# EAGLE board MainBoard (EAGLE 6.4), part 1 of 2
REVISION: B; TITLE: Teton
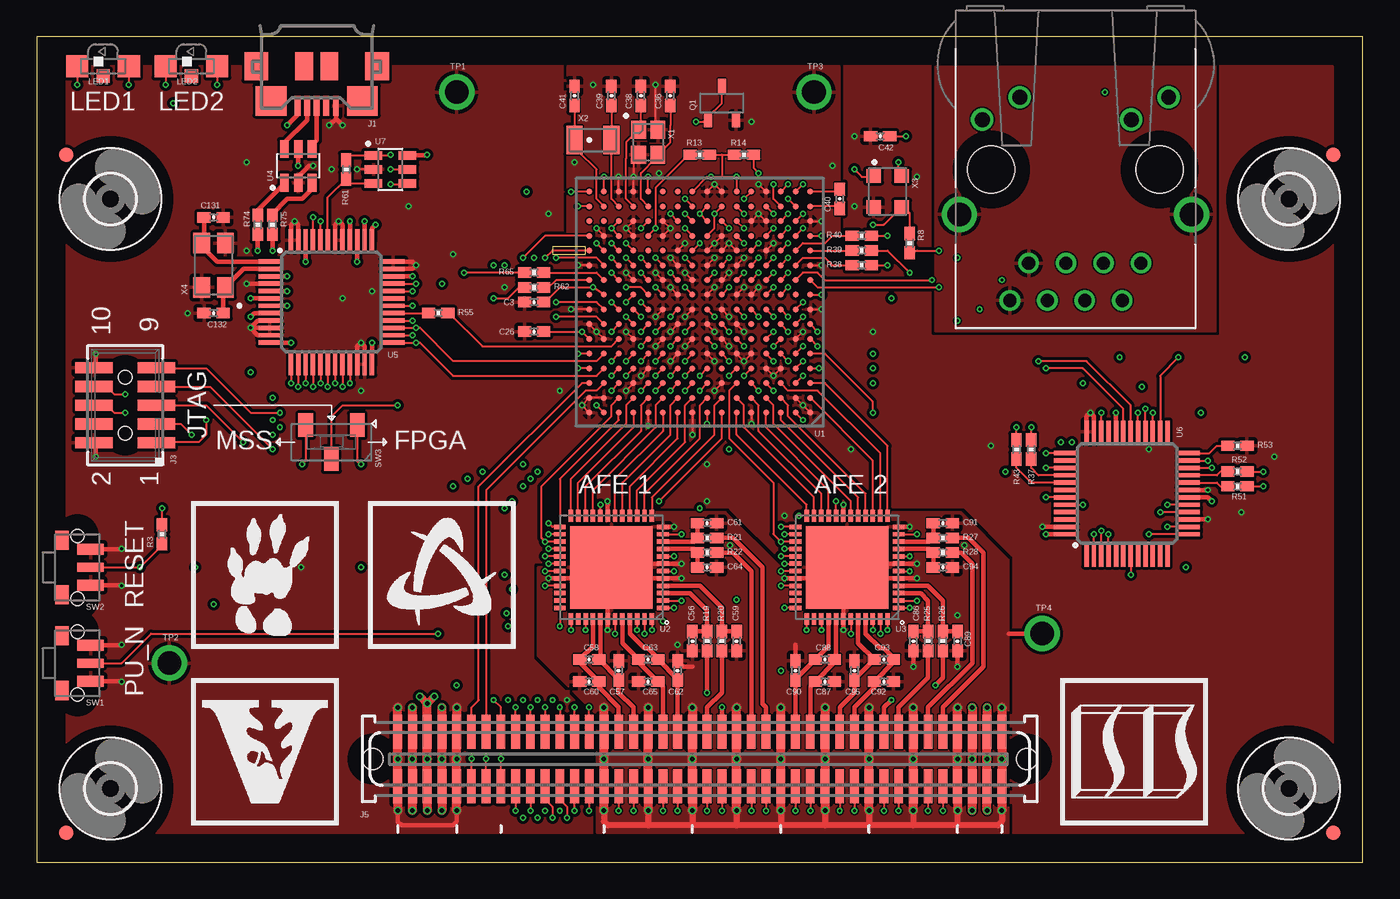
[diagram p10: board, top side]
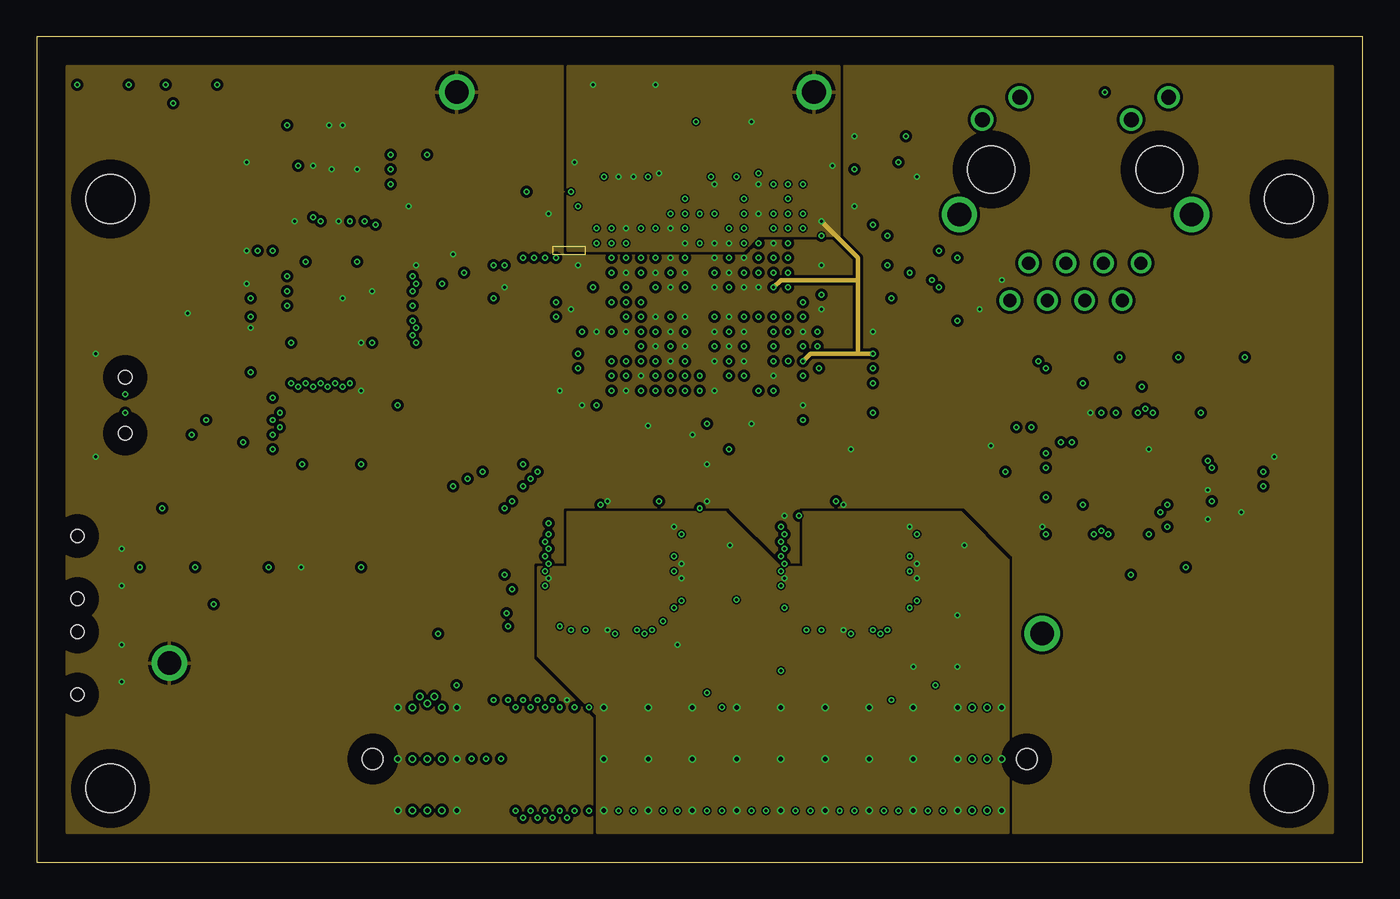
[diagram p11: board, inner layer GND]
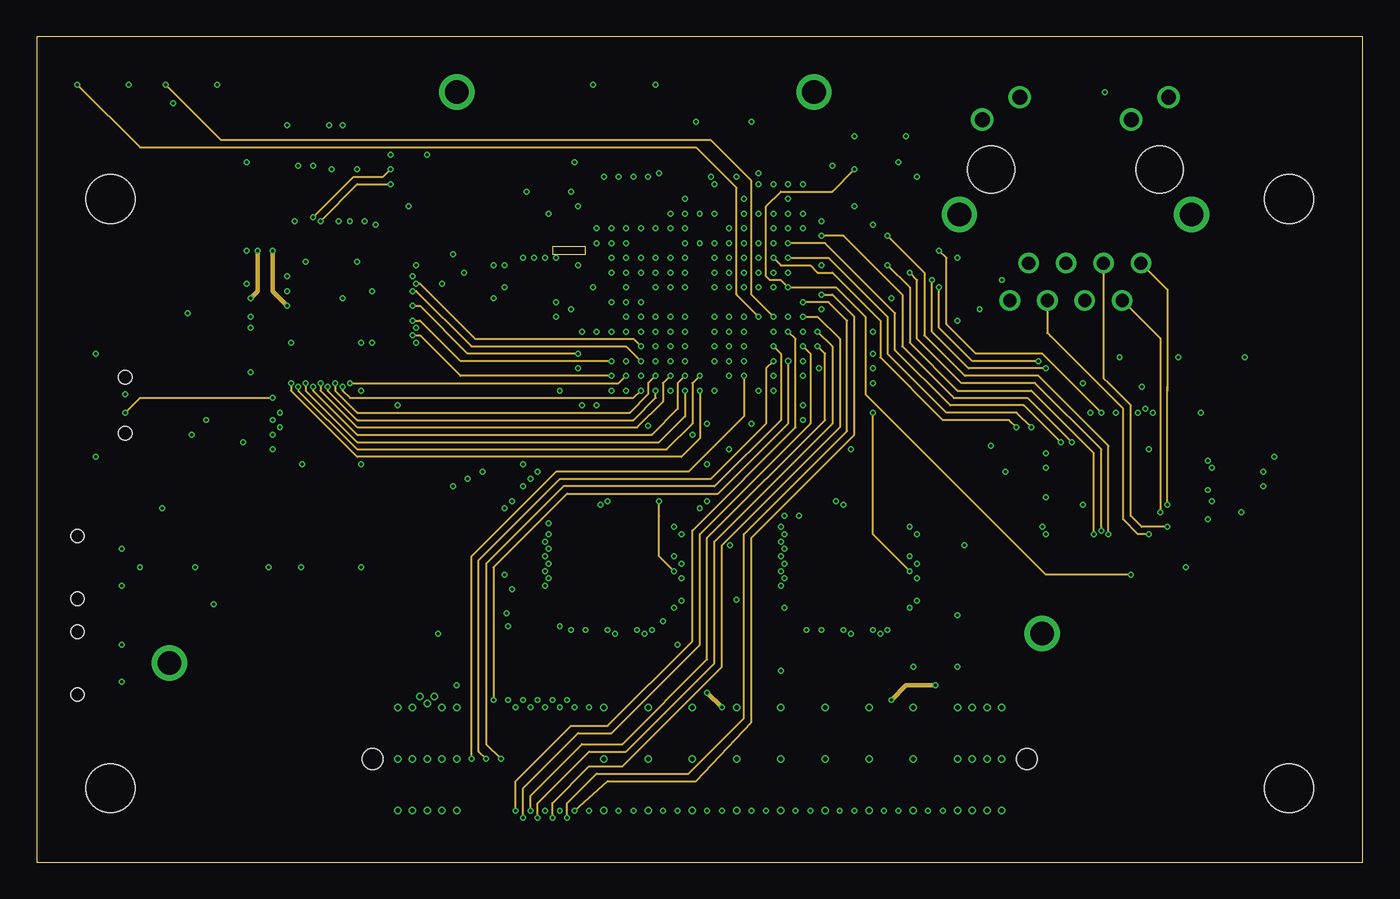
[diagram p12: board, inner layer Inner1]
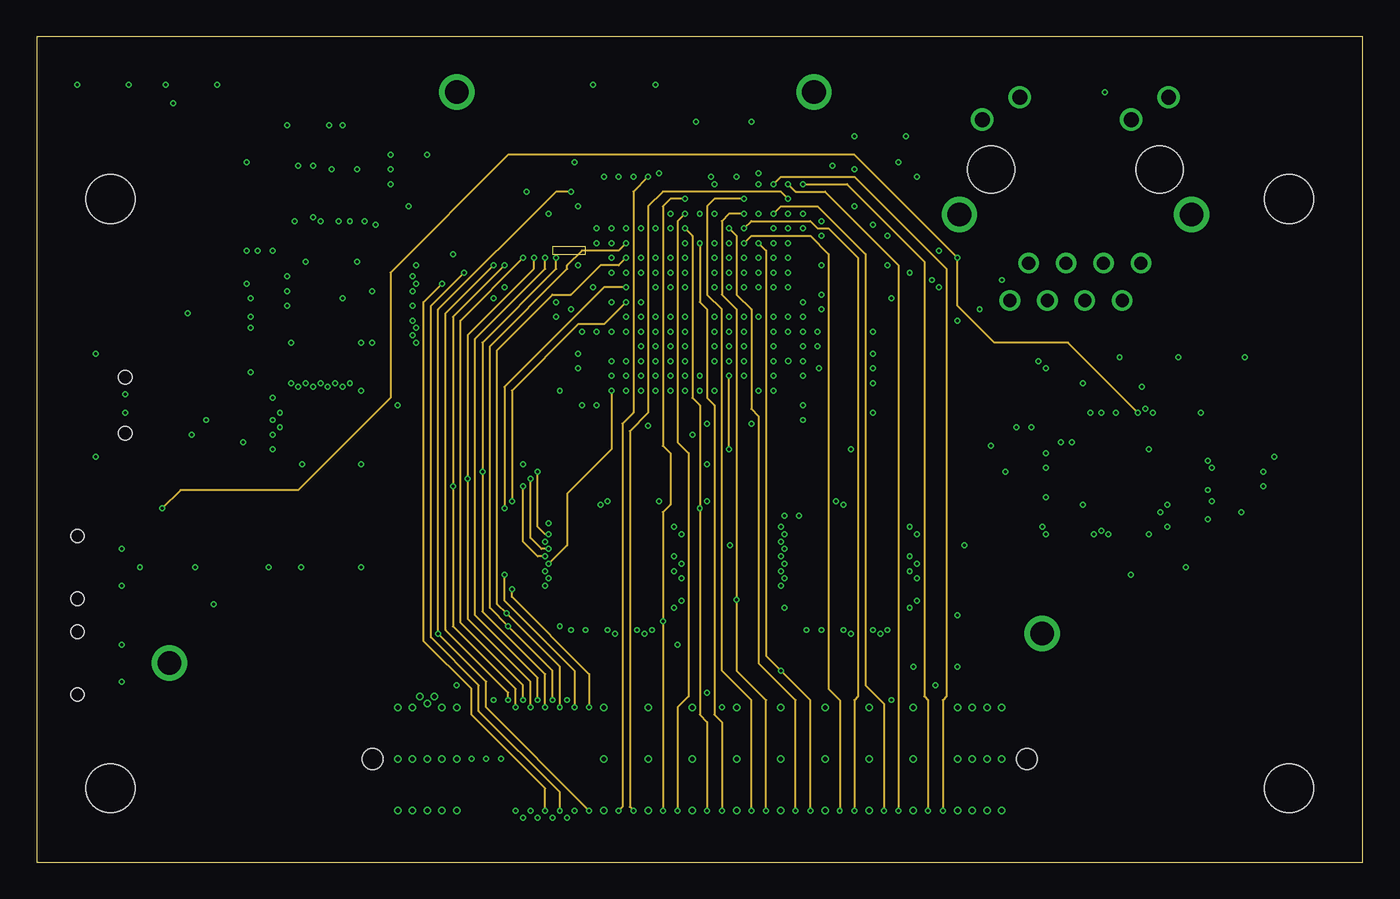
[diagram p13: board, inner layer Inner2]
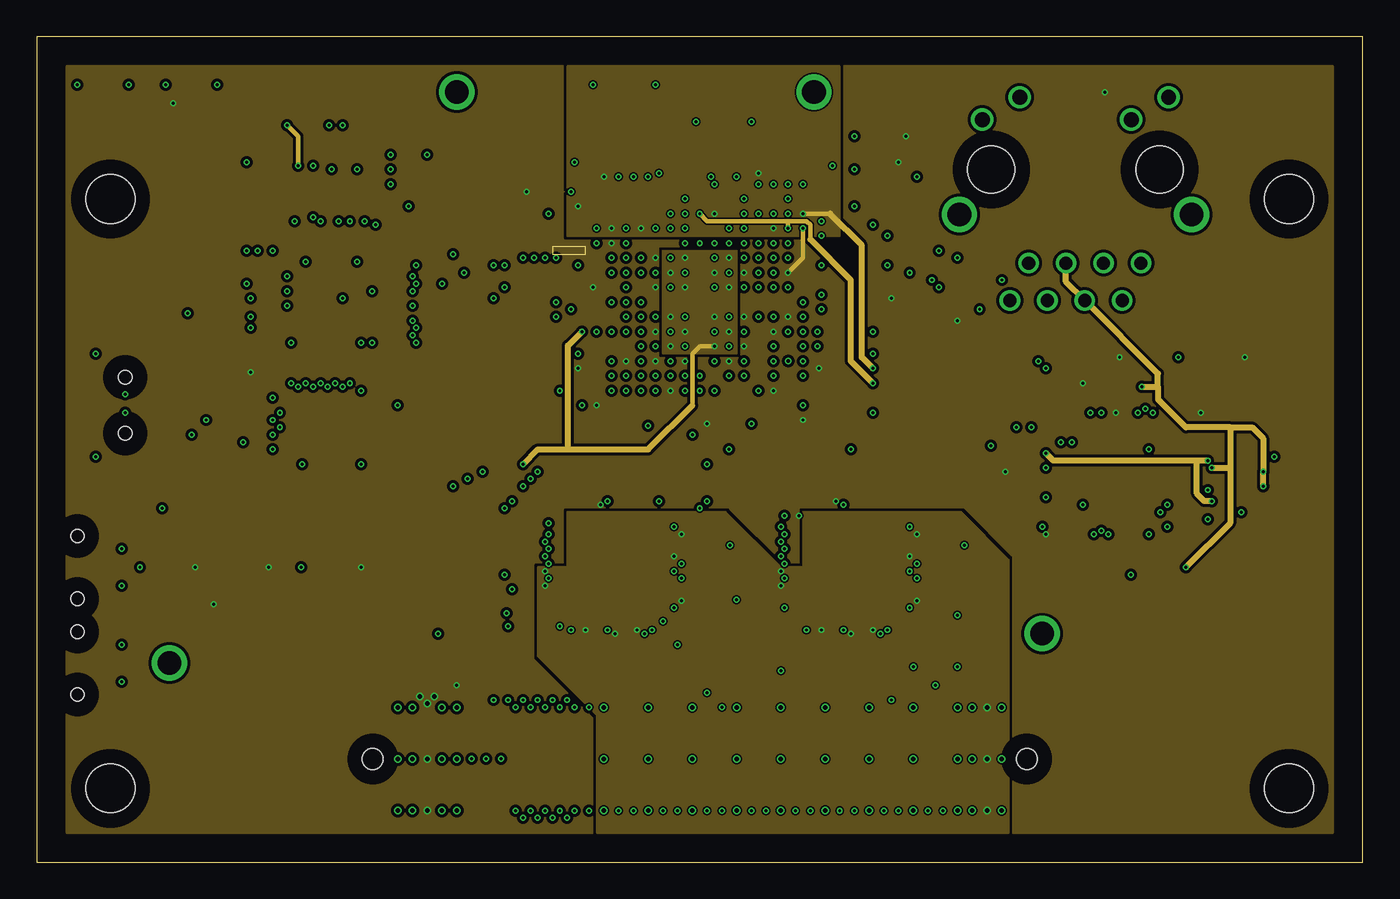
[diagram p14: board, inner layer D3V3]
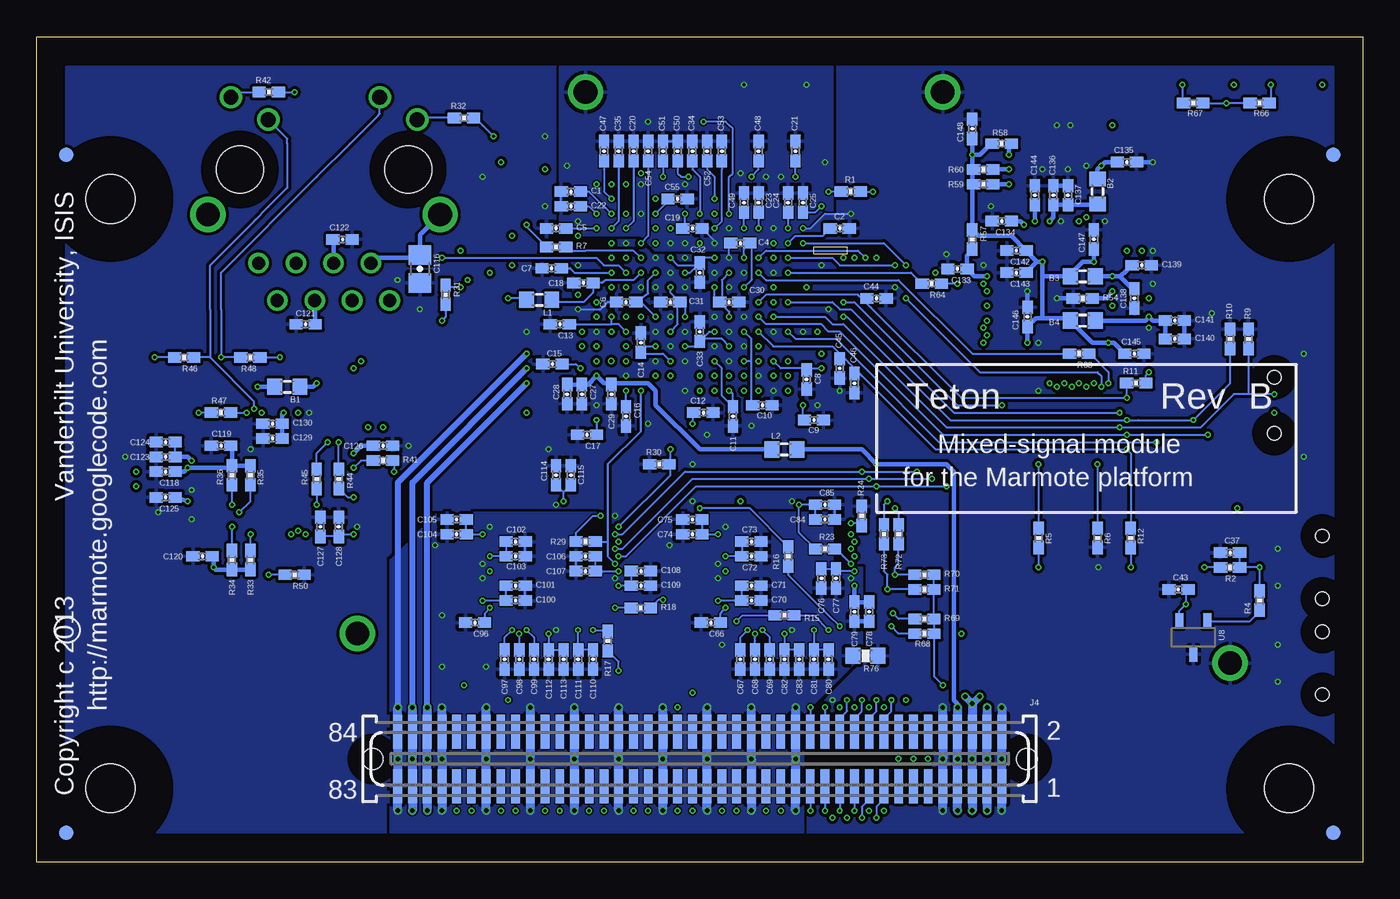
[diagram p15: board, bottom side, seen from below]

Size 90 x 56 mm. Coordinates in mm from the lower left corner, seen from the top.
Outline: 0,0 90,0 90,56 0,56 0,0
Copper layers (1*2*3+14*15*16): Top 0.0356mm / dielectric 5mil / GND 0.0356mm / dielectric 5mil / Inner1 0.0356mm / dielectric 40mil / Inner2 0.0356mm / dielectric 5mil / D3V3 0.0356mm / dielectric 5mil / Bottom 0.0356mm
Design rules "default": minimum track width 4mil, minimum drill 8mil, track to track 4mil, track to pad 4mil, pad to pad 4mil, via to via 4mil, smd to smd 4mil, copper to edge 40mil, drill to drill 8mil, minimum pad ring 10mil, minimum via ring 4mil, stop-mask expansion 2mil, vias tented up to drill 8mil, thermal gap 10mil
Milling: area 35,41.2 to 37.2,41.8

## Footprints (pad centres in the part's own frame; a part is rotated, then mirrored left to right if it is on the bottom)
L0603 = smd 1 x 1.1: 1 -0.85,0; 2 0.85,0
C0402 = smd 0.9 x 0.7: 1 -0.65,0; 2 0.65,0
C0805 = smd 1.3 x 1.5: 1 -0.95,0; 2 0.95,0
ZX62R-B-5P = smd 0.4 x 1.35: 1 1.3,2.675; 2 0.65,2.675; 3 0,2.675; 4 -0.65,2.675; 5 -1.3,2.675 | smd 2.1 x 2: MNT$1 -3.1,2.35; MNT$2 3.1,2.35 | smd 1.6 x 1.9: MNT$3 -4.1,0; MNT$4 4.1,0 | smd 1.2 x 1.9: MNT$5 -0.85,0; MNT$6 0.85,0
J0011D21B = drill 0.889: 1 4.445,-6.35; 2 3.175,-8.89; 3 1.905,-6.35; 4 0.635,-8.89; 5 -0.635,-6.35; 6 -1.905,-8.89; 7 -3.175,-6.35; 8 -4.445,-8.89 | drill 1.016: 9 6.325,4.902; 10 3.785,3.378; 11 -3.785,4.902; 12 -6.325,3.378 | drill 1.6: H$1 -7.874,-3.048; H$2 7.874,-3.048 | hole 3.2: -5.715,0; 5.715,0
FTSH-105-01-L-DV-K = smd 2.54 x 0.762: 1 -2.121,2.54; 2 2.121,2.54; 3 -2.121,1.27; 4 2.121,1.27; 5 -2.121,0; 6 2.121,0; 7 -2.121,-1.27; 8 2.121,-1.27; 9 -2.121,-2.54; 10 2.121,-2.54 | hole 0.94: 0,1.905; 0,-1.905
71742-3003-BOT = smd 0.6 x 2.3: 1 -20.5,1.85; 2 -20.5,-1.85; 3 -19.5,1.85; 4 -19.5,-1.85; 5 -18.5,1.85; 6 -18.5,-1.85; 7 -17.5,1.85; 8 -17.5,-1.85; 9 -16.5,1.85; 10 -16.5,-1.85; 11 -15.5,1.85; 12 -15.5,-1.85; 13 -14.5,1.85; 14 -14.5,-1.85; 15 -13.5,1.85; 16 -13.5,-1.85; 17 -12.5,1.85; 18 -12.5,-1.85; 19 -11.5,1.85; 20 -11.5,-1.85; 21 -10.5,1.85; 22 -10.5,-1.85; 23 -9.5,1.85; 24 -9.5,-1.85; 25 -8.5,1.85; 26 -8.5,-1.85; 27 -7.5,1.85; 28 -7.5,-1.85; 29 -6.5,1.85; 30 -6.5,-1.85; 31 -5.5,1.85; 32 -5.5,-1.85; 33 -4.5,1.85; 34 -4.5,-1.85; 35 -3.5,1.85; 36 -3.5,-1.85; 37 -2.5,1.85; 38 -2.5,-1.85; 39 -1.5,1.85; 40 -1.5,-1.85; 41 -0.5,1.85; 42 -0.5,-1.85; 43 0.5,1.85; 44 0.5,-1.85; 45 1.5,1.85; 46 1.5,-1.85; 47 2.5,1.85; 48 2.5,-1.85; 49 3.5,1.85; 50 3.5,-1.85; 51 4.5,1.85; 52 4.5,-1.85; 53 5.5,1.85; 54 5.5,-1.85; 55 6.5,1.85; 56 6.5,-1.85; 57 7.5,1.85; 58 7.5,-1.85; 59 8.5,1.85; 60 8.5,-1.85; 61 9.5,1.85; 62 9.5,-1.85; 63 10.5,1.85; 64 10.5,-1.85; 65 11.5,1.85; 66 11.5,-1.85; 67 12.5,1.85; 68 12.5,-1.85; 69 13.5,1.85; 70 13.5,-1.85; 71 14.5,1.85; 72 14.5,-1.85; 73 15.5,1.85; 74 15.5,-1.85; 75 16.5,1.85; 76 16.5,-1.85; 77 17.5,1.85; 78 17.5,-1.85; 79 18.5,1.85; 80 18.5,-1.85; 81 19.5,1.85; 82 19.5,-1.85; 83 20.5,1.85; 84 20.5,-1.85 | hole 1.4: -22.2,0; 22.2,0
71741-0002 = smd 0.6 x 2.3: 1 -20.5,-1.85; 2 -20.5,1.85; 3 -19.5,-1.85; 4 -19.5,1.85; 5 -18.5,-1.85; 6 -18.5,1.85; 7 -17.5,-1.85; 8 -17.5,1.85; 9 -16.5,-1.85; 10 -16.5,1.85; 11 -15.5,-1.85; 12 -15.5,1.85; 13 -14.5,-1.85; 14 -14.5,1.85; 15 -13.5,-1.85; 16 -13.5,1.85; 17 -12.5,-1.85; 18 -12.5,1.85; 19 -11.5,-1.85; 20 -11.5,1.85; 21 -10.5,-1.85; 22 -10.5,1.85; 23 -9.5,-1.85; 24 -9.5,1.85; 25 -8.5,-1.85; 26 -8.5,1.85; 27 -7.5,-1.85; 28 -7.5,1.85; 29 -6.5,-1.85; 30 -6.5,1.85; 31 -5.5,-1.85; 32 -5.5,1.85; 33 -4.5,-1.85; 34 -4.5,1.85; 35 -3.5,-1.85; 36 -3.5,1.85; 37 -2.5,-1.85; 38 -2.5,1.85; 39 -1.5,-1.85; 40 -1.5,1.85; 41 -0.5,-1.85; 42 -0.5,1.85; 43 0.5,-1.85; 44 0.5,1.85; 45 1.5,-1.85; 46 1.5,1.85; 47 2.5,-1.85; 48 2.5,1.85; 49 3.5,-1.85; 50 3.5,1.85; 51 4.5,-1.85; 52 4.5,1.85; 53 5.5,-1.85; 54 5.5,1.85; 55 6.5,-1.85; 56 6.5,1.85; 57 7.5,-1.85; 58 7.5,1.85; 59 8.5,-1.85; 60 8.5,1.85; 61 9.5,-1.85; 62 9.5,1.85; 63 10.5,-1.85; 64 10.5,1.85; 65 11.5,-1.85; 66 11.5,1.85; 67 12.5,-1.85; 68 12.5,1.85; 69 13.5,-1.85; 70 13.5,1.85; 71 14.5,-1.85; 72 14.5,1.85; 73 15.5,-1.85; 74 15.5,1.85; 75 16.5,-1.85; 76 16.5,1.85; 77 17.5,-1.85; 78 17.5,1.85; 79 18.5,-1.85; 80 18.5,1.85; 81 19.5,-1.85; 82 19.5,1.85; 83 20.5,-1.85; 84 20.5,1.85 | hole 1.4: -22.2,0; 22.2,0
LED1208-RA = smd 1.5 x 1.5: 1 -1.75,0; 2 1.75,0 | smd 0.9 x 0.9: 3 0,-0.65
3,3 = hole 3.3: 0,0
FIDUCIAL-1X2 = smd 1 x 1: 1 0,0
SOT23-3L = smd 1 x 0.55: 1 -1.15,0.95; 2 -1.15,-0.95; 3 1.15,0
R0402 = smd 0.9 x 0.7: 1 -0.65,0; 2 0.65,0
R0603 = smd 1 x 1.1: 1 -0.85,0; 2 0.85,0
TL3340 = smd 0.75 x 1.8: 1 1.225,2.4; 3 -1.225,2.4 | smd 0.6 x 1.8: 2 0,2.4 | smd 1.3 x 0.9: MNT$1 -1.85,0.45; MNT$2 1.85,0.45 | hole 0.9: 2.125,1.5; -2.125,1.5
SWITCH-DIP-CJS = smd 1 x 1.6: 1 -1.75,-1.15; 2 0,1.15; 3 1.75,-1.15
TESTPOINT = drill 1.6: 1 0,0
FG256 = smd 0.4 x 0.4: A1 -7.5,7.5; A2 -6.5,7.5; A3 -5.5,7.5; A4 -4.5,7.5; A5 -3.5,7.5; A6 -2.5,7.5; A7 -1.5,7.5; A8 -0.5,7.5; A9 0.5,7.5; A10 1.5,7.5; A11 2.5,7.5; A12 3.5,7.5; A13 4.5,7.5; A14 5.5,7.5; A15 6.5,7.5; A16 7.5,7.5; B1 -7.5,6.5; B2 -6.5,6.5; B3 -5.5,6.5; B4 -4.5,6.5; B5 -3.5,6.5; B6 -2.5,6.5; B7 -1.5,6.5; B8 -0.5,6.5; B9 0.5,6.5; B10 1.5,6.5; B11 2.5,6.5; B12 3.5,6.5; B13 4.5,6.5; B14 5.5,6.5; B15 6.5,6.5; B16 7.5,6.5; C1 -7.5,5.5; C2 -6.5,5.5; C3 -5.5,5.5; C4 -4.5,5.5; C5 -3.5,5.5; C6 -2.5,5.5; C7 -1.5,5.5; C8 -0.5,5.5; C9 0.5,5.5; C10 1.5,5.5; C11 2.5,5.5; C12 3.5,5.5; C13 4.5,5.5; C14 5.5,5.5; C15 6.5,5.5; C16 7.5,5.5; D1 -7.5,4.5; D2 -6.5,4.5; D3 -5.5,4.5; D4 -4.5,4.5; D5 -3.5,4.5; D6 -2.5,4.5; D7 -1.5,4.5; D8 -0.5,4.5; D9 0.5,4.5; D10 1.5,4.5; D11 2.5,4.5; D12 3.5,4.5; D13 4.5,4.5; D14 5.5,4.5; D15 6.5,4.5; D16 7.5,4.5; E1 -7.5,3.5; E2 -6.5,3.5; E3 -5.5,3.5; E4 -4.5,3.5; E5 -3.5,3.5; E6 -2.5,3.5; E7 -1.5,3.5; E8 -0.5,3.5; E9 0.5,3.5; E10 1.5,3.5; E11 2.5,3.5; E12 3.5,3.5; E13 4.5,3.5; E14 5.5,3.5; E15 6.5,3.5; E16 7.5,3.5; F1 -7.5,2.5; F2 -6.5,2.5; F3 -5.5,2.5; F4 -4.5,2.5; F5 -3.5,2.5; F6 -2.5,2.5; F7 -1.5,2.5; F8 -0.5,2.5; F9 0.5,2.5; F10 1.5,2.5; F11 2.5,2.5; F12 3.5,2.5; F13 4.5,2.5; F14 5.5,2.5; F15 6.5,2.5; F16 7.5,2.5; G1 -7.5,1.5; G2 -6.5,1.5; G3 -5.5,1.5; G4 -4.5,1.5; G5 -3.5,1.5; G6 -2.5,1.5; G7 -1.5,1.5; G8 -0.5,1.5; G9 0.5,1.5; G10 1.5,1.5; G11 2.5,1.5; G12 3.5,1.5; G13 4.5,1.5; G14 5.5,1.5; G15 6.5,1.5; G16 7.5,1.5; H1 -7.5,0.5; H2 -6.5,0.5; H3 -5.5,0.5; H4 -4.5,0.5; H5 -3.5,0.5; H6 -2.5,0.5; H7 -1.5,0.5; H8 -0.5,0.5; H9 0.5,0.5; H10 1.5,0.5; H11 2.5,0.5; H12 3.5,0.5; H13 4.5,0.5; H14 5.5,0.5; H15 6.5,0.5; H16 7.5,0.5; J1 -7.5,-0.5; J2 -6.5,-0.5; J3 -5.5,-0.5; J4 -4.5,-0.5; J5 -3.5,-0.5; J6 -2.5,-0.5; J7 -1.5,-0.5; J8 -0.5,-0.5; J9 0.5,-0.5; J10 1.5,-0.5; J11 2.5,-0.5; J12 3.5,-0.5; J13 4.5,-0.5; J14 5.5,-0.5; J15 6.5,-0.5; J16 7.5,-0.5; K1 -7.5,-1.5; K2 -6.5,-1.5; K3 -5.5,-1.5; K4 -4.5,-1.5; K5 -3.5,-1.5; K6 -2.5,-1.5; K7 -1.5,-1.5; K8 -0.5,-1.5; K9 0.5,-1.5; K10 1.5,-1.5; K11 2.5,-1.5; K12 3.5,-1.5; K13 4.5,-1.5; K14 5.5,-1.5; K15 6.5,-1.5; K16 7.5,-1.5; L1 -7.5,-2.5; L2 -6.5,-2.5; L3 -5.5,-2.5; L4 -4.5,-2.5; L5 -3.5,-2.5; L6 -2.5,-2.5; L7 -1.5,-2.5; L8 -0.5,-2.5; L9 0.5,-2.5; L10 1.5,-2.5; L11 2.5,-2.5; L12 3.5,-2.5; L13 4.5,-2.5; L14 5.5,-2.5; L15 6.5,-2.5; L16 7.5,-2.5; M1 -7.5,-3.5; M2 -6.5,-3.5; M3 -5.5,-3.5; M4 -4.5,-3.5; M5 -3.5,-3.5; M6 -2.5,-3.5; M7 -1.5,-3.5; M8 -0.5,-3.5; M9 0.5,-3.5; M10 1.5,-3.5; M11 2.5,-3.5; M12 3.5,-3.5; M13 4.5,-3.5; M14 5.5,-3.5; M15 6.5,-3.5; M16 7.5,-3.5; N1 -7.5,-4.5; N2 -6.5,-4.5; N3 -5.5,-4.5; N4 -4.5,-4.5; N5 -3.5,-4.5; N6 -2.5,-4.5; N7 -1.5,-4.5; N8 -0.5,-4.5; N9 0.5,-4.5; N10 1.5,-4.5; N11 2.5,-4.5; N12 3.5,-4.5; N13 4.5,-4.5; N14 5.5,-4.5; N15 6.5,-4.5; N16 7.5,-4.5; P1 -7.5,-5.5; P2 -6.5,-5.5; P3 -5.5,-5.5; P4 -4.5,-5.5; P5 -3.5,-5.5; P6 -2.5,-5.5; P7 -1.5,-5.5; P8 -0.5,-5.5; P9 0.5,-5.5; P10 1.5,-5.5; P11 2.5,-5.5; P12 3.5,-5.5; P13 4.5,-5.5; P14 5.5,-5.5; P15 6.5,-5.5; P16 7.5,-5.5; R1 -7.5,-6.5; R2 -6.5,-6.5; R3 -5.5,-6.5; R4 -4.5,-6.5; R5 -3.5,-6.5; R6 -2.5,-6.5; R7 -1.5,-6.5; R8 -0.5,-6.5; R9 0.5,-6.5; R10 1.5,-6.5; R11 2.5,-6.5; R12 3.5,-6.5; R13 4.5,-6.5; R14 5.5,-6.5; R15 6.5,-6.5; R16 7.5,-6.5; T1 -7.5,-7.5; T2 -6.5,-7.5; T3 -5.5,-7.5; T4 -4.5,-7.5; T5 -3.5,-7.5; T6 -2.5,-7.5; T7 -1.5,-7.5; T8 -0.5,-7.5; T9 0.5,-7.5; T10 1.5,-7.5; T11 2.5,-7.5; T12 3.5,-7.5; T13 4.5,-7.5; T14 5.5,-7.5; T15 6.5,-7.5; T16 7.5,-7.5
TQFN-48 = smd 0.8 x 0.3: 1 -3.5,2.75; 2 -3.5,2.25; 3 -3.5,1.75; 4 -3.5,1.25; 5 -3.5,0.75; 6 -3.5,0.25; 7 -3.5,-0.25; 8 -3.5,-0.75; 9 -3.5,-1.25; 10 -3.5,-1.75; 11 -3.5,-2.25; 12 -3.5,-2.75; 25 3.5,-2.75; 26 3.5,-2.25; 27 3.5,-1.75; 28 3.5,-1.25; 29 3.5,-0.75; 30 3.5,-0.25; 31 3.5,0.25; 32 3.5,0.75; 33 3.5,1.25; 34 3.5,1.75; 35 3.5,2.25; 36 3.5,2.75 | smd 0.3 x 0.8: 13 -2.75,-3.5; 14 -2.25,-3.5; 15 -1.75,-3.5; 16 -1.25,-3.5; 17 -0.75,-3.5; 18 -0.25,-3.5; 19 0.25,-3.5; 20 0.75,-3.5; 21 1.25,-3.5; 22 1.75,-3.5; 23 2.25,-3.5; 24 2.75,-3.5; 37 2.75,3.5; 38 2.25,3.5; 39 1.75,3.5; 40 1.25,3.5; 41 0.75,3.5; 42 0.25,3.5; 43 -0.25,3.5; 44 -0.75,3.5; 45 -1.25,3.5; 46 -1.75,3.5; 47 -2.25,3.5; 48 -2.75,3.5 | smd 5.6 x 5.6: EXP 0,0
SOT23-6L = smd 1.2 x 0.6: 1 -1.15,0.95; 2 -1.15,0; 3 -1.15,-0.95; 4 1.15,-0.95; 5 1.15,0; 6 1.15,0.95
LQFP-48 = smd 1.5 x 0.3: 1 -4.2,2.75; 2 -4.2,2.25; 3 -4.2,1.75; 4 -4.2,1.25; 5 -4.2,0.75; 6 -4.2,0.25; 7 -4.2,-0.25; 8 -4.2,-0.75; 9 -4.2,-1.25; 10 -4.2,-1.75; 11 -4.2,-2.25; 12 -4.2,-2.75; 25 4.2,-2.75; 26 4.2,-2.25; 27 4.2,-1.75; 28 4.2,-1.25; 29 4.2,-0.75; 30 4.2,-0.25; 31 4.2,0.25; 32 4.2,0.75; 33 4.2,1.25; 34 4.2,1.75; 35 4.2,2.25; 36 4.2,2.75 | smd 0.3 x 1.5: 13 -2.75,-4.2; 14 -2.25,-4.2; 15 -1.75,-4.2; 16 -1.25,-4.2; 17 -0.75,-4.2; 18 -0.25,-4.2; 19 0.25,-4.2; 20 0.75,-4.2; 21 1.25,-4.2; 22 1.75,-4.2; 23 2.25,-4.2; 24 2.75,-4.2; 37 2.75,4.2; 38 2.25,4.2; 39 1.75,4.2; 40 1.25,4.2; 41 0.75,4.2; 42 0.25,4.2; 43 -0.25,4.2; 44 -0.75,4.2; 45 -1.25,4.2; 46 -1.75,4.2; 47 -2.25,4.2; 48 -2.75,4.2
ECX-2236 = smd 1.2 x 1: 1 -0.85,-0.65; 2 0.85,-0.65; 3 0.85,0.65; 4 -0.85,0.65
ECX-31B = smd 1.1 x 1.9: 1 -1.25,0; 2 1.25,0
ASEM1 = smd 0.9 x 1: 1 -1.05,-0.95; 2 1.05,-0.95; 3 1.05,0.95; 4 -1.05,0.95
ECX-42 = smd 1.4 x 1.15: 1 -1.5,-0.8; 2 1.5,-0.8; 3 1.5,0.8; 4 -1.5,0.8

## Placement (x,y rotation side)
B1  70R/4A  [L0603]  73,32.25 180 bottom
B2  600R/0.5A  [L0603]  18,45.5 270 bottom
B3  600R/0.5A  [L0603]  19,39.75 0 bottom
B4  600R/0.5A  [L0603]  19,36.75 0 bottom
C1  2.2uF  [C0402]  53.75,45.5 180 bottom
C2  0.1uF  [C0402]  35.5,43 0 bottom
C3  0.1uF  [C0402]  33.75,38 180 top
C4  0.1uF  [C0402]  42.25,42 180 bottom
C5  0.1uF  [C0402]  54.75,43 180 bottom
C6  0.1uF  [C0402]  50,38 180 bottom
C7  0.1uF  [C0402]  55.05,40.3 180 bottom
C8  0.1uF  [C0402]  37.75,32.75 270 bottom
C9  0.1uF  [C0402]  37.25,30 0 bottom
C10  0.1uF  [C0402]  40.75,31 0 bottom
C11  0.1uF  [C0402]  42.75,30.25 270 bottom
C12  0.1uF  [C0402]  44.75,30.5 0 bottom
C13  0.1uF  [C0402]  54.5,36.5 180 bottom
C14  0.1uF  [C0402]  49,35.25 90 bottom
C15  0.1uF  [C0402]  55,33.8 180 bottom
C16  0.1uF  [C0402]  50,30.25 270 bottom
C17  0.1uF  [C0402]  52.65,29 180 bottom
C18  0.1uF  [C0402]  52.9,39.3 180 bottom
C19  0.1uF  [C0402]  45.5,43 0 bottom
C20  0.1uF  [C0402]  49.5,48.25 90 bottom
C21  0.1uF  [C0402]  38.5,48.25 90 bottom
C22  0.1uF  [C0402]  53.75,44.5 180 bottom
C23  0.1uF  [C0402]  41,44.75 90 bottom
C24  0.1uF  [C0402]  39,44.75 90 bottom
C25  0.1uF  [C0402]  38,44.75 90 bottom
C26  0.1uF  [C0402]  33.75,36 180 top
C27  4.7uF  [C0402]  53,31.75 270 bottom
C28  0.1uF  [C0402]  54,31.75 270 bottom
C29  0.01uF  [C0402]  51,31.75 270 bottom
C30  0.1uF  [C0402]  43,38 0 bottom
C31  0.1uF  [C0402]  47,38 180 bottom
C32  0.1uF  [C0402]  45,40 270 bottom
C33  0.1uF  [C0402]  45,36 90 bottom
C34  0.1uF  [C0402]  45.5,48.25 90 bottom
C35  0.1uF  [C0402]  50.5,48.25 90 bottom
C36  10pF  [C0402]  43,52 90 top
C37  0.1uF  [C0402]  9,21 180 bottom
C38  10pF  [C0402]  41,52 90 top
C39  4pF  [C0402]  39,52 90 top
C40  2.2uF  [C0402]  54.5,45 90 top
C41  4pF  [C0402]  36.5,52 90 top
C42  0.01uF  [C0402]  57.25,49.25 180 top
C43  0.1uF  [C0402]  12.5,18.5 180 bottom
C44  0.1uF  [C0402]  33,38.25 0 bottom
C45  0.33uF  [C0402]  35.5,33.5 270 bottom
C46  0.01uF  [C0402]  34.5,32.5 270 bottom
C47  [C0402]  51.5,48.25 90 bottom
C48  [C0402]  41,48.25 90 bottom
C49  4.7uF  [C0402]  42,44.75 90 bottom
C50  4.7uF  [C0402]  46.5,48.25 90 bottom
C51  4.7uF  [C0402]  47.5,48.25 90 bottom
C52  [C0402]  44.5,48.25 90 bottom
C53  [C0402]  43.5,48.25 90 bottom
C54  [C0402]  48.5,48.25 90 bottom
C55  [C0402]  46.5,45 0 bottom
C56  22pF  [C0402]  44.5,15 270 top
C57  [C0402]  39.5,13 90 top
C58  [C0402]  37.5,13.75 180 top
C59  22pF  [C0402]  47.5,15 90 top
C60  [C0402]  37.5,12.25 0 top
C61  22pF  [C0402]  45.5,23 0 top
C62  [C0402]  43.5,13 90 top
C63  [C0402]  41.5,13.75 180 top
C64  22pF  [C0402]  45.5,20 180 top
C65  [C0402]  41.5,12.25 0 top
C66  0.33uF  [C0402]  44.25,16.25 180 bottom
C67  0.33uF  [C0402]  42.25,13.75 270 bottom
C68  0.33uF  [C0402]  41.25,13.75 270 bottom
C69  0.1uF  [C0402]  40.25,13.75 270 bottom
C70  2.2uF  [C0402]  41.5,17.75 0 bottom
C71  0.1uF  [C0402]  41.5,18.75 0 bottom
C72  2.2uF  [C0402]  41.5,20.75 0 bottom
C73  0.1uF  [C0402]  41.5,21.75 0 bottom
C74  2.2uF  [C0402]  45.5,22.25 180 bottom
C75  0.1uF  [C0402]  45.5,23.25 180 bottom
C76  2.2uF  [C0402]  36.75,19.25 270 bottom
C77  0.1uF  [C0402]  35.75,19.25 270 bottom
C78  2.2uF  [C0402]  33.5,17 270 bottom
C79  0.1uF  [C0402]  34.5,17 270 bottom
C80  2.2uF  [C0402]  36.25,13.75 270 bottom
C81  0.1uF  [C0402]  37.25,13.75 270 bottom
C82  2.2uF  [C0402]  39.25,13.75 270 bottom
C83  0.1uF  [C0402]  38.25,13.75 270 bottom
C84  2.2uF  [C0402]  36.5,23.25 0 bottom
C85  0.1uF  [C0402]  36.5,24.25 0 bottom
C86  22pF  [C0402]  59.5,15 270 top
C87  [C0402]  53.5,12.25 0 top
C88  [C0402]  53.5,13.75 180 top
C89  22pF  [C0402]  62.5,15 90 top
C90  [C0402]  51.5,13 270 top
C91  22pF  [C0402]  61.5,23 0 top
C92  [C0402]  57.5,12.25 0 top
C93  [C0402]  57.5,13.75 180 top
C94  22pF  [C0402]  61.5,20 180 top
C95  [C0402]  55.5,13 270 top
C96  0.33uF  [C0402]  60.25,16.25 180 bottom
C97  0.33uF  [C0402]  58.25,13.75 270 bottom
C98  0.33uF  [C0402]  57.25,13.75 270 bottom
C99  0.1uF  [C0402]  56.25,13.75 270 bottom
C100  2.2uF  [C0402]  57.5,17.75 0 bottom
C101  0.1uF  [C0402]  57.5,18.75 0 bottom
C102  2.2uF  [C0402]  57.5,20.75 0 bottom
C103  0.1uF  [C0402]  57.5,21.75 0 bottom
C104  2.2uF  [C0402]  61.5,22.25 180 bottom
C105  0.1uF  [C0402]  61.5,23.25 180 bottom
C106  2.2uF  [C0402]  52.75,20.75 180 bottom
C107  0.1uF  [C0402]  52.75,19.75 180 bottom
C108  2.2uF  [C0402]  49,19.75 0 bottom
C109  0.1uF  [C0402]  49,18.75 0 bottom
C110  2.2uF  [C0402]  52.25,13.75 270 bottom
C111  0.1uF  [C0402]  53.25,13.75 270 bottom
C112  2.2uF  [C0402]  55.25,13.75 270 bottom
C113  0.1uF  [C0402]  54.25,13.75 270 bottom
C114  2.2uF  [C0402]  54.75,26.25 90 bottom
C115  0.1uF  [C0402]  53.75,26.25 90 bottom
C116  1000pF  [C0805]  64,40.25 270 bottom
C118  0.1uF  [C0402]  81.25,26.5 180 bottom
C119  0.1uF  [C0402]  77.5,28.25 180 bottom
C120  0.1uF  [C0402]  78.75,20.75 180 bottom
C121  0.1uF  [C0402]  71.75,36.5 180 bottom
C122  0.1uF  [C0402]  69.25,42.25 0 bottom
C123  4.7uF  [C0402]  81.25,27.5 180 bottom
C124  0.1uF  [C0402]  81.25,28.5 180 bottom
C125  0.1uF  [C0402]  81.25,24.75 180 bottom
C126  0.1uF  [C0402]  66.5,28.25 0 bottom
C127  4.7uF  [C0402]  70.75,22.75 90 bottom
C128  0.1uF  [C0402]  69.5,22.75 90 bottom
C129  4.7uF  [C0402]  74,28.75 180 bottom
C130  0.1uF  [C0402]  74,29.75 180 bottom
C131  10pF  [C0402]  12,43.75 0 top
C132  10pF  [C0402]  12,37.25 180 top
C133  0.01uF  [C0402]  27.5,40.25 180 bottom
C134  0.1uF  [C0402]  24.5,43.5 180 bottom
C135  0.01uF  [C0402]  16,47.5 0 bottom
C136  4.7uF  [C0402]  21,45.25 90 bottom
C137  0.1uF  [C0402]  20,45.25 90 bottom
C138  4.7uF  [C0402]  15.5,38.25 270 bottom
C139  0.1uF  [C0402]  15,40.5 0 bottom
C140  4.7uF  [C0402]  12.75,35.5 0 bottom
C141  0.1uF  [C0402]  12.75,36.75 0 bottom
C142  4.7uF  [C0402]  23.5,41.5 180 bottom
C143  0.1uF  [C0402]  23.5,40 180 bottom
C144  0.1uF  [C0402]  22.25,45.25 90 bottom
C145  0.1uF  [C0402]  15.5,34.5 0 bottom
C146  0.1uF  [C0402]  22.75,37 90 bottom
C147  0.1uF  [C0402]  18.25,42.25 90 bottom
C148  0.1uF  [C0402]  26.5,49.75 90 bottom
J1  CON-ZX62R-B-5P  [ZX62R-B-5P]  19,54 180 top
J2  CON-RJ45-J0011D21BNL  [J0011D21B]  70.5,47 0 top
J3  CON-FTSH-105-01-L-DV-K  [FTSH-105-01-L-DV-K]  6,31 180 top
J4  CON-71741-2184-BOT  [71742-3003-BOT]  45,7 180 bottom
J5  CON-71741-2184-TOP  [71741-0002]  45,7 0 top
L1  33nH  [L0603]  55.9,38.15 180 bottom
L2  33nH  [L0603]  39.25,28 0 bottom
LED1  [LED1208-RA]  4.5,54 0 top
LED2  [LED1208-RA]  10.5,54 0 top
LOGO1  LOGO-VANDERBILT-600MIL-10MM-SS  [LOGO-VANDERBILT-10MM-SILKSCREEN]  10.5,2.5 0 top
LOGO2  LOGO-ISIS-600MIL-10MM-SS  [LOGO-ISIS-10MM-SILKSCREEN]  69.5,2.5 0 top
LOGO3  LOGO-MARMOTE-600MIL-10MM-SS  [LOGO-MARMOTE-10MM-SILKSCREEN]  10.5,14.5 0 top
LOGO4  LOGO-SMARTFUSION-600MIL-10MM-SS  [LOGO-SMARTFUSION-10MM-SILKSCREEN]  22.5,14.5 0 top
M1  MOUNT-HOLE3.3  [3,3]  5,5 0 top
M2  MOUNT-HOLE3.3  [3,3]  5,45 0 top
M3  MOUNT-HOLE3.3  [3,3]  85,45 0 top
M4  MOUNT-HOLE3.3  [3,3]  85,5 0 top
M5  FIDUCIAL1X2  [FIDUCIAL-1X2]  2,2 0 top
M6  FIDUCIAL1X2  [FIDUCIAL-1X2]  2,48 0 top
M7  FIDUCIAL1X2  [FIDUCIAL-1X2]  88,48 0 top
M8  FIDUCIAL1X2  [FIDUCIAL-1X2]  88,2 0 top
M9  FIDUCIAL1X2  [FIDUCIAL-1X2]  2,2 90 bottom
M10  FIDUCIAL1X2  [FIDUCIAL-1X2]  2,48 0 bottom
M11  FIDUCIAL1X2  [FIDUCIAL-1X2]  88,48 0 bottom
M12  FIDUCIAL1X2  [FIDUCIAL-1X2]  88,2 0 bottom
Q1  MMBT3904  [SOT23-3L]  46.5,51.5 90 top
R1  10k  [R0402]  34.75,45.5 180 bottom
R2  10k  [R0402]  9,20 180 bottom
R3  39  [R0402]  8.5,22.25 90 top
R4  0  [R0402]  7,17.75 90 bottom
R5  1k  [R0402]  22,22 270 bottom
R6  1k  [R0402]  18,22 90 bottom
R7  39  [R0402]  54.75,41.75 0 bottom
R8  39  [R0402]  59.25,42 270 top
R9  1k  [R0402]  7.75,35.5 270 bottom
R10  1k  [R0402]  9,35.5 270 bottom
R11  0  [R0402]  15.37,32.5 0 bottom
R12  0  [R0402]  15.75,22 270 bottom
R13  0  [R0402]  45,48 0 top
R14  0  [R0402]  48,48 0 top
R15  0  [R0402]  39.25,16.75 180 bottom
R16  0  [R0402]  39,20.75 90 bottom
R17  0  [R0402]  51.25,15 270 bottom
R18  0  [R0402]  49,17.25 0 bottom
R19  24.9  [R0402]  45.5,15 270 top
R20  24.9  [R0402]  46.5,15 270 top
R21  24.9  [R0402]  45.5,22 0 top
R22  24.9  [R0402]  45.5,21 0 top
R23  100k  [R0402]  36.5,21.25 180 bottom
R24  100k  [R0402]  34,23.5 270 bottom
R25  24.9  [R0402]  60.5,15 270 top
R26  24.9  [R0402]  61.5,15 270 top
R27  24.9  [R0402]  61.5,22 0 top
R28  24.9  [R0402]  61.5,21 0 top
R29  100k  [R0402]  52.75,21.75 180 bottom
R30  100k  [R0402]  47.75,27 0 bottom
R31  1.5k  [R0402]  62.25,38.5 270 bottom
R32  100  [R0402]  61,50.5 0 bottom
R33  49.9  [R0402]  75.5,20.5 270 bottom
R34  49.9  [R0402]  76.75,20.5 270 bottom
R35  49.9  [R0402]  75.5,26.25 90 bottom
R36  49.9  [R0402]  76.75,26.25 90 bottom
R37  22  [R0402]  67.5,28 270 top
R38  22  [R0402]  56,40.5 0 top
R39  22  [R0402]  56,41.5 0 top
R40  22  [R0402]  56,42.5 0 top
R41  2.2k  [R0402]  66.5,27.25 0 bottom
R42  100  [R0402]  74.25,52.25 0 bottom
R43  22  [R0402]  66.5,28 270 top
R44  22  [R0402]  69.5,26 270 bottom
R45  22  [R0402]  71,26 270 bottom
R46  2.2k  [R0402]  80,34.25 180 bottom
R47  2.2k  [R0402]  77.5,30.5 180 bottom
R48  2.2k  [R0402]  75.5,34.25 0 bottom
R50  2.2k  [R0402]  72.5,19.5 180 bottom
R51  2.2k  [R0402]  81.5,25.5 0 top
R52  2.2k  [R0402]  81.5,26.5 0 top
R53  4.87k  [R0402]  81.5,28.25 180 top
R54  12k  [R0402]  19,38.25 0 bottom
R55  27  [R0402]  27.25,37.25 0 top
R57  10k  [R0402]  26.5,42.25 270 bottom
R58  10k  [R0402]  24.5,48.75 180 bottom
R59  10k  [R0402]  25.75,46 180 bottom
R60  10k  [R0402]  25.75,47 180 bottom
R61  2k  [R0402]  21,47 270 top
R62  39  [R0402]  33.75,39 0 top
R63  39  [R0402]  19.25,34.5 180 bottom
R64  39  [R0402]  29.25,39.25 180 bottom
R65  39  [R0402]  33.75,40 0 top
R66  100  [R0402]  7,51.5 180 bottom
R67  330  [R0402]  11.5,51.5 0 bottom
R68  100k  [R0402]  29.75,15.5 0 bottom
R69  100k  [R0402]  29.75,16.5 0 bottom
R70  4.7k  [R0402]  29.75,19.5 0 bottom
R71  4.7k  [R0402]  29.75,18.5 0 bottom
R72  100  [R0402]  31.5,22.25 270 bottom
R73  100  [R0402]  32.5,22.25 270 bottom
R74  0  [R0402]  15,43.25 270 top
R75  0  [R0402]  16,43.25 270 top
R76  0  [R0603]  33.75,14 180 bottom
SW1  SWITCH-ESWITCH-TL3340G  [TL3340]  1.25,13.5 270 top
SW2  SWITCH-ESWITCH-TL3340G  [TL3340]  1.25,20 270 top
SW3  SWITCH-CJS-1200TA  [SWITCH-DIP-CJS]  20,28.5 180 top
TP1  TESTPOINT-YELLOW  [TESTPOINT]  28.5,52.25 0 top
TP2  TESTPOINT-YELLOW  [TESTPOINT]  9,13.5 0 top
TP3  TESTPOINT-GREEN  [TESTPOINT]  52.75,52.25 0 top
TP4  TESTPOINT-GREEN  [TESTPOINT]  68.25,15.5 0 top
U1  A2F500M3G-1FGG256  [FG256]  45,38 180 top
U2  MAX19706-T4877-4  [TQFN-48]  39,20 180 top
U3  MAX19706-T4877-4  [TQFN-48]  55,20 180 top
U4  USBLC6-2SC6  [SOT23-6L]  17.75,47.25 90 top
U5  FT232HL  [LQFP-48]  20,38 0 top
U6  DP83848C-VBH48A  [LQFP-48]  74,25 90 top
U7  93LC56BT-OT  [SOT23-6L]  24,47 0 top
U8  DS1818-10-SOT-23  [SOT23-3L]  11.5,15.25 270 bottom
X1  ECX-2236-200  [ECX-2236]  41.5,48.85 270 top
X2  ECX-31B  [ECX-31B]  37.75,49 0 top
X3  ASEM1-C  [ASEM1]  57.75,45.5 270 top
X4  ECX-42-120  [ECX-42]  12,40.5 90 top